# EAGLE design AS726x-Spectral_REV-D (EAGLE 6.4)
COMPANY: ADAFRUIT INDUSTRIES; DRAWN: KTOWN; REV: A
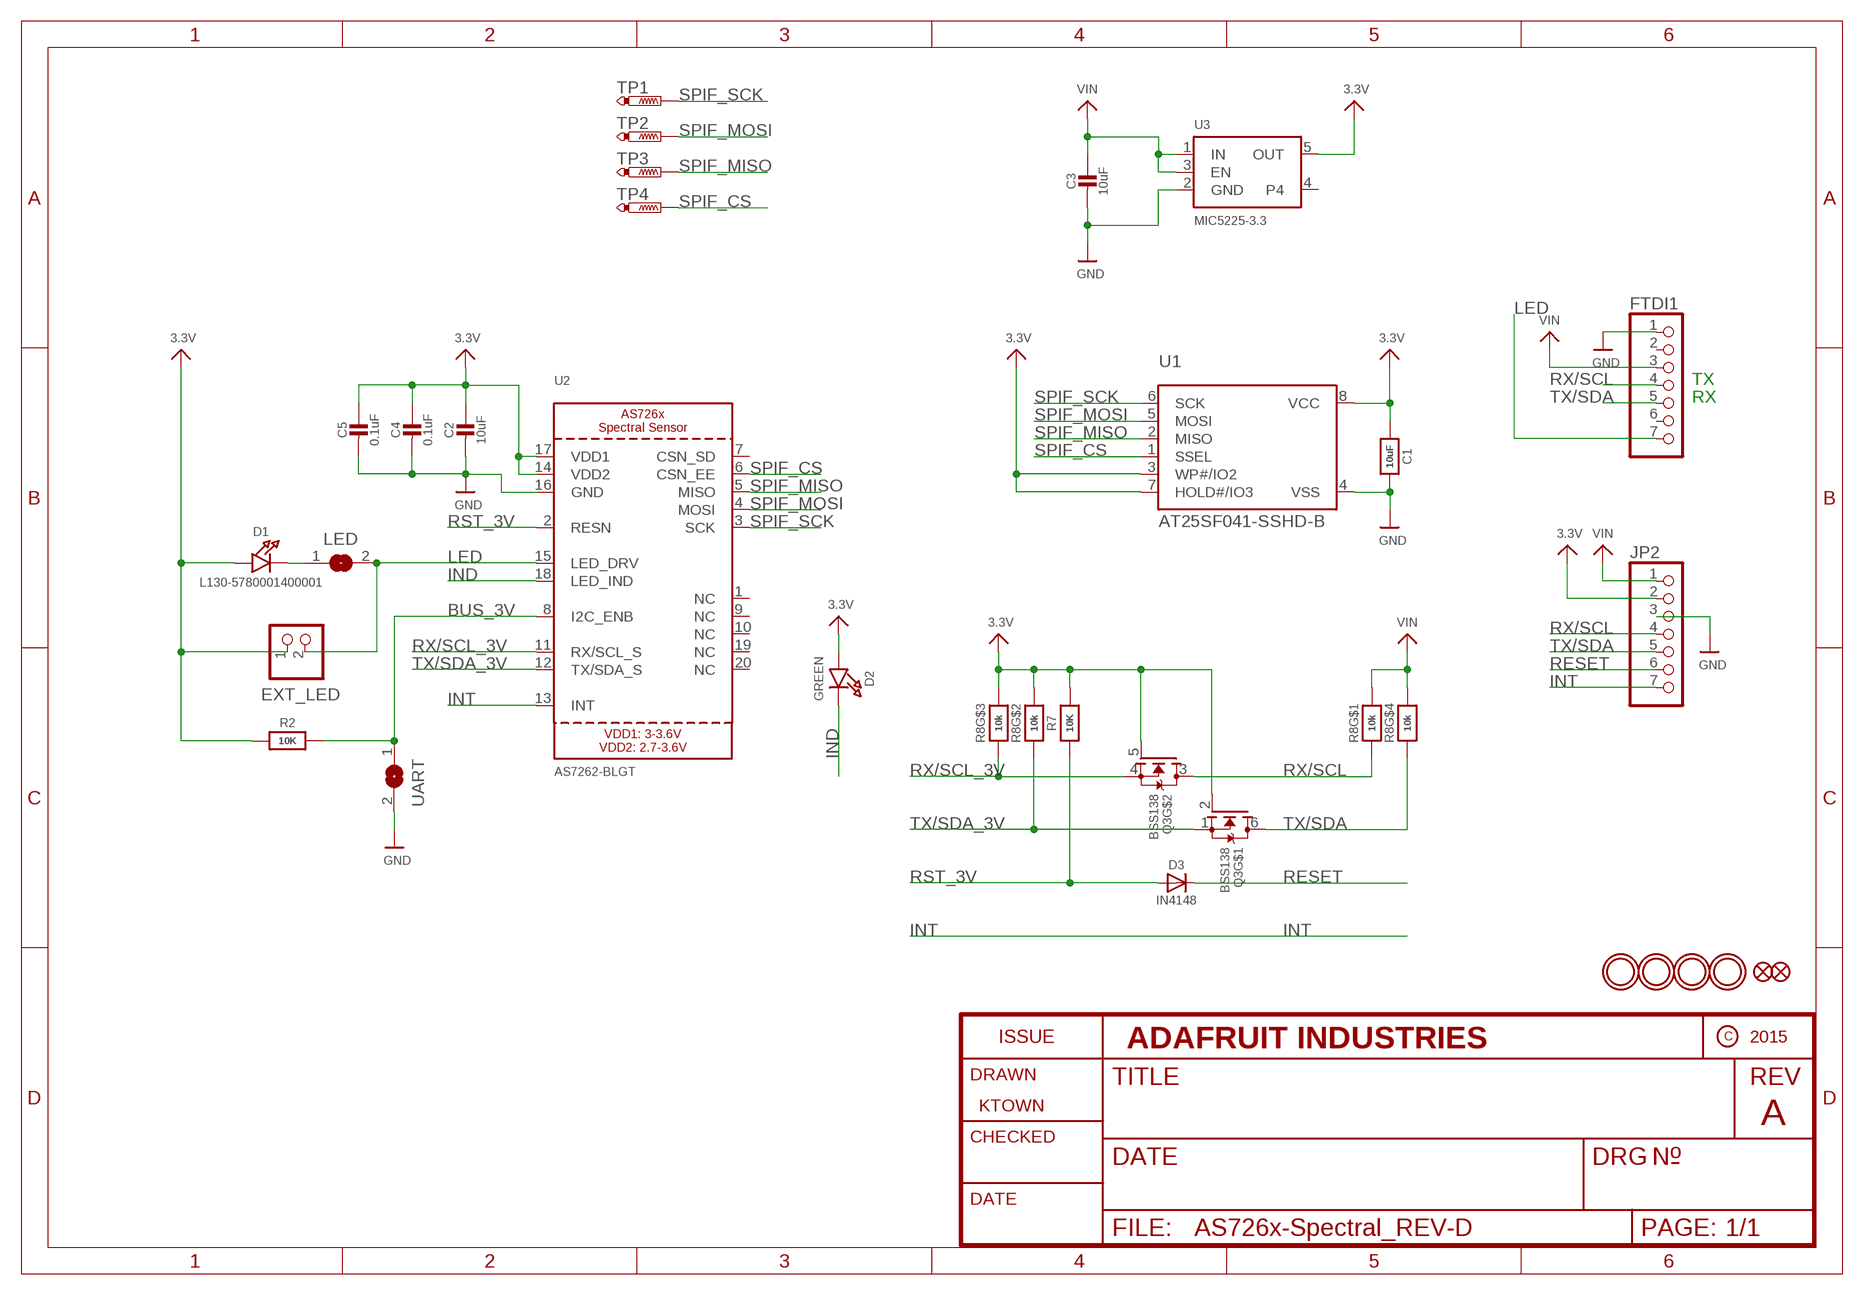
[diagram p0: schematic, sheet 1]

## Parts
C1  10uF  RESISTOR0805_NOOUTLINE  [0805-NO]
C2  10uF  CAP_CERAMIC0805-NOOUTLINE  [0805-NO]
C3  10uF  CAP_CERAMIC0805-NOOUTLINE  [0805-NO]
C4  0.1uF  CAP_CERAMIC0603_NO  [0603-NO]
C5  0.1uF  CAP_CERAMIC0603_NO  [0603-NO]
D1  L130-5780001400001  LEDEV45-21  [EVERLIGHT_45-21]
D2  GREEN  LED0805_NOOUTLINE  [CHIPLED_0805_NOOUTLINE]
D3  IN4148  DIODESOD-323  [SOD-323]
EXT_LED  HEADER-1X2ROUND  [1X02_ROUND]
FID2  FIDUCIAL_1MM  [FIDUCIAL_1MM]
FID3  FIDUCIAL_1MM  [FIDUCIAL_1MM]
FTDI1  HEADER-1X7ROUND  [1X07_ROUND]
JP2  HEADER-1X7ROUND  [1X07_ROUND]
LED  SOLDERJUMPERCLOSED  [SOLDERJUMPER_CLOSEDWIRE]
Q3  BSS138  MOSFET-N_DUAL  [SOT363]
R2  10K  RESISTOR0805_NOOUTLINE  [0805-NO]
R7  10K  RESISTOR_0603_NOOUT  [0603-NO]
R8  10k  RESISTOR_4PACK_NO  [RESPACK_4X0603_NO]
TP1  PTR1TP15R  [TP15R]
TP2  PTR1TP15R  [TP15R]
TP3  PTR1TP15R  [TP15R]
TP4  PTR1TP15R  [TP15R]
U1  AT25SF041-SSHD-B  SPIFLASH_SOIC8  [SOIC8_150MIL]
U2  AS7262-BLGT  AS726X_SPECTRAL  [AS726X_LGA20]
U3  MIC5225-3.3  VREG_SOT23-5  [SOT23-5]
U$2  MOUNTINGHOLE2.5  [MOUNTINGHOLE_2.5_PLATED]
U$3  MOUNTINGHOLE2.5  [MOUNTINGHOLE_2.5_PLATED]
U$22  MOUNTINGHOLE2.5  [MOUNTINGHOLE_2.5_PLATED]
U$23  MOUNTINGHOLE2.5  [MOUNTINGHOLE_2.5_PLATED]
UART  SOLDERJUMPER  [SOLDERJUMPER_ARROW_NOPASTE]

## Nets
3.3V: C1.1 C2.1 C4.1 C5.1 D1.A D2.A EXT_LED.1 JP2.2 Q3.2(G) Q3.5(G) R2.1 R7.2 R8.6 R8.7 U1.3(WP#/IO2) U1.7(HOLD#/IO3) U1.8(VCC) U2.14(VDD2) U2.17(VDD1) U3.5(OUT)
BUS_3V: R2.2 U2.8(I2C_ENB) UART.1
GND: C1.2 C2.2 C3.2 C4.2 C5.2 FTDI1.1 JP2.3 U1.4(VSS) U2.16(GND) U3.2(GND) UART.2
IND: D2.C U2.18(LED_IND)
INT: JP2.7 U2.13(INT)
LED: EXT_LED.2 FTDI1.7 LED.2 U2.15(LED_DRV)
N$1: D1.K(C) LED.1
RESET: D3.C JP2.6
RST_3V: D3.A R7.1 U2.2(RESN)
RX/SCL: FTDI1.4 JP2.4 Q3.3(D) R8.1
RX/SCL_3V: Q3.4(S) R8.3 U2.11(RX/SCL_S)
SPIF_CS: TP4.TP U1.1(SSEL) U2.6(CSN_EE)
SPIF_MISO: TP3.TP U1.2(MISO) U2.5(MISO)
SPIF_MOSI: TP2.TP U1.5(MOSI) U2.4(MOSI)
SPIF_SCK: TP1.TP U1.6(SCK) U2.3(SCK)
TX/SDA: FTDI1.5 JP2.5 Q3.6(D) R8.4
TX/SDA_3V: Q3.1(S) R8.2 U2.12(TX/SDA_S)
VIN: C3.1 FTDI1.3 JP2.1 R8.5 R8.8 U3.1(IN) U3.3(EN)
Unconnected: FTDI1.2 FTDI1.6 U2.1(NC) U2.7(CSN_SD) U2.9(NC) U2.10(NC) U2.19(NC) U2.20(NC) U3.4

## Notes on the sheet
- TX
- RX

## Library data of the parts
C1 R2 = microbuilder:RESISTOR: Resistors For new designs, use the packages preceded by an '_' character since they are more reliable: The following footprints should be used on most boards: _0402 - Standard footprint for regular board layouts _0603 - Standard footprint for regular board layouts _0805 - Standard footprint for regular board layouts _1206 - Standard footprint for regular board layouts For extremely tight-pitch boards where space is at a premium, the following 'micro-pitch' footprints can be used (smaller pads, no silkscreen outline, etc.): _0402MP - Micro-pitch footprint for very dense/compact boards _0603MP - Micro-pitch footprint for very dense/compact boards _0805MP - Micro-pitch footprint for very dense/compact boards _1206MP - Micro-pitch footprint for very dense/compact boards
C2-C5 = microbuilder_09_Nov_2015:CAP_CERAMIC: Ceramic Capacitors For new designs, use the packages preceded by an '_' character since they are more reliable: The following footprints should be used on most boards: _0402 - Standard footprint for regular board layouts _0603 - Standard footprint for regular board layouts _0805 - Standard footprint for regular board layouts _1206 - Standard footprint for regular board layouts For extremely tight-pitch boards where space is at a premium, the following 'micro-pitch' footprints can be used (smaller pads, no silkscreen outline, etc.): _0402MP - Micro-pitch footprint for very dense/compact boards _0603MP - Micro-pitch footprint for very dense/compact boards _0805MP - Micro-pitch footprint for very dense/compact boards _1206MP - Micro-pitch footprint for very dense/compact boards
D1 D2 = microbuilder:LED: LED 0603 - 0603 Surface Mount Package 2mA: Green LED - Low Power (3.9mcd, 2ma, 1.7Vf) - Digikey: 475-2709-2-ND Orange LED - Low Power (9.8mcd, 2ma, 1.8Vf) - Digikey: 475-1194-2-ND Red LED - Low Power (5mcd, 2ma, 1.8Vf) - Digikey: 475-1195-2-ND Yellow LED - Low Power (7mcd, 2ma, 1.8Vf) - Digikey: 475-1196-2-ND 5mA: Blue LED - Low Power (17mcd, 5ma, 2.9Vf) - Digikey: LNJ937W8CRACT-ND 0805 - 0805 Surface Mount Package 2mA: Red LED (8.8mcd, 2mA, 1.8Vf, Clear) - Low Power [Digikey: 475-2510-1-ND] Green LED (5mcd, 2mA, 1.8Vf, Clear) - Low Power [Digikey: 475-2730-1-ND] Yellow LED (11.3mcd, 2mA, 1.8Vf, Clear) - Low Power [Digikey: 475-2555-1-ND] 20mA: Red LED (104mcd, 20mA, Diffused) - LS R976 [Digikey: 475-1278-6-ND] Red LED (12mcd, 20mA, 2.0Vf, Clear) - APT2012EC [Digikey: 754-1128-1-ND] Green LED (15mcd, 20mA, 2.2Vf, Clear) - APT2012GC [Digikey: 754-1131-1-ND] Orange LED (160mcd, 20mA, 2.1Vf, Clear) - APT2012SECK [Digikey: 754-1130-1-ND] 1206 - 1206 Surface Mount Package Green LED (26mcd, 20mA, Diffused) - LG N971 [Digikey: 475-1407-6-ND] Red LED (15mcd, 20mA, Diffused) - LH N974 [Digikey: 475-1416-6-ND] Cree - Cree High-Power Surface Mount LEDs XPEBWT-L1-0000-00D50 - White 111lm 350mA 2.9Vf 6200K 110° XTEAWT-00-0000-00000LEE3 - White 114lm 350mA 2.85Vf 5000K 115° Everlight - Everlight 45-21 Series Surface Mount LEDs 45-21/QK2C-B2832AC2CB2/2T - Warm White 2000mcd 20mA 3.25Vf 3050K 120° 45-21/LK2C-B38452C4CB2/2T - Nuetral White 2000mcd 20mA 3.25Vf 4150K 120° 45-21/LK2C-B50634C6CB2/2T - Cold White 2200mcd 20mA 3.25Vf 5650K 120° PLCC2 Reverse Mount LS T77K-J1L2-1-0-2-R18-Z - Red 11.25mcd 2mA 1.8Vf 630nm 120° LO T77K-L1M2-24-Z - Orange 19.6mcd 2mA 1.8Vf 606nm 120° LY T77K-K2M1-26-Z - Yellow 15.7mcd 2mA 1.8Vf 587nm 120°
D3 = microbuilder:DIODE: Diode SMA Model Volts Amps Type Vf Ir Digikey # Notes SSA34-E3 40V 3A Schottky 480mV @ 3A 200uA @ 40V SSA34-E3/61TGITR-ND CDBA120-G 20V 1A Schottky 500mV @ 1A 500uA @ 20V 641-1014-6-ND REEL MBRA210 10V 2A Schottky 350mV @ 2A 700uA @ 10V MBRA210LT3 SOD-123 Model Volts Amps Type Vf Ir Order # Notes BAT54T1G 30V 200mA Schottky 800mV @ 200mA 2uA @ 25V BAT54T1GOSTR-ND B0530W 30V 500mA Schottky 430mV @ 500mA 130uA @ 30V B0530W-FDICT-ND REEL MBR120 20V 1A Schottky 340mV @ 1A MBR120VLSFT1GOSCT-ND SOD-323 Model Volts Amps Type Vf Ir Order # Notes PMEG2005EJ 20V 500mA Schottky 355mV @ 500mA 568-4110-1-ND ZLLS410 10V 570mA Schottky 380mV @ 570mA ZLLS410CT-ND 1N4148WS 75V 150mA Silicon/Simple 1V 1N4148WSFSCT-ND REEL SOD-523 Model Volts Amps Type Vf Ir Order # Notes BAT54XV2 30V 200mA Schottky 0.8V @ 100mA BAT54XV2CT-ND TB751S 30V 30mA Schottky RB751S-40TE61CT-ND SOT23-R/W (R = Solder Paste/Reflow Ovens, W = Hand-Soldering) Model Volts Amps Type Vf Ir Order # Notes BAT54FILM 40V 300mA Schottky 497-7162-1-ND POWERDI-5 Model Volts Amps Type Vf Ir Order # Notes PDS560 60V 5A Schottky 670mV @ 5A 150uA @ 60V PDS560DICT-ND
EXT_LED = microbuilder:HEADER-1X2: PIN HEADER
FID2 FID3 = microbuilder:FIDUCIAL: Fiducial Alignment Points Various fiducial points for machine vision alignment.; BOM: EXCLUDE
FTDI1 JP2 = microbuilder:HEADER-1X7: PIN HEADER
LED = microbuilder:SOLDERJUMPER: SMD Solder JUMPER Solder the two pads together to create a connection, or remove the solder to break it. REFLOW - Use this footprint for solder paste and reflow ovens. WAVE - Use this footprint for hand-soldering (larger pads). CLOSED - Has a trace between the two pads to ensure it is closed by default. The trace needs to be cut to disable the jumper, and can be closed again by creating a solder bridge between the two pads.
Q3 = microbuilder:MOSFET-N_DUAL: Dual N-Channel MOSFET SOT363 (2.0x1.25mm) 2N7002PS - 60V, 320mA [Digikey: 568-5984-1-ND]
R7 = microbuilder_09_Nov_2015:RESISTOR: Resistors For new designs, use the packages preceded by an '_' character since they are more reliable: The following footprints should be used on most boards: _0402 - Standard footprint for regular board layouts _0603 - Standard footprint for regular board layouts _0805 - Standard footprint for regular board layouts _1206 - Standard footprint for regular board layouts For extremely tight-pitch boards where space is at a premium, the following 'micro-pitch' footprints can be used (smaller pads, no silkscreen outline, etc.): _0402MP - Micro-pitch footprint for very dense/compact boards _0603MP - Micro-pitch footprint for very dense/compact boards _0805MP - Micro-pitch footprint for very dense/compact boards _1206MP - Micro-pitch footprint for very dense/compact boards
R8 = microbuilder:RESISTOR_4PACK: Resistor Packs (4 resistors) 4 x 0603 10K 1/16W - Digikey: YC164J-10KCT-ND
TP1-TP4 = testpad:PTR1: TEST PIN
U1 = microbuilder_09_Nov_2015:SPIFLASH_SOIC8: SOIC8 SPI Flash Be careful with the size since SOIC8 flash comes in several 'widths' SOIC8 150 mil M25P16 - 16Mbit (2Mbit x 8) Serial Flash (75MHz SPI Bus), Supply: 2.7-3.6V Digikey: SOIC8 - M25P16-VMN6P-ND SOIC8 208 mil W25Q16BVSSIG - 16Mbit (2Mbit x 8) Serial Flash (104MHz SPI Bus), Supply: 2.7-3.6V Digikey: SOIC8 - W25Q16BVSSIG-ND
U2 = microbuilder:AS726X_SPECTRAL: AS726x Spectral Sensor
U3 = microbuilder:VREG_SOT23-5: SOT23-5 Fixed Voltage Regulators Part Current Out V Out V In V Dropout θJA (°C/W) TJ (°C) Digikey Part No. ADP121 150mA 3.3V 3.4-5.5V 0.09V @ 150mA -- -- ADP121-AUJZ33R7CT-ND ADP121 150mA 3.0V 3.1-5.5V 0.09V @ 150mA -- -- ADP121-AUJZ30R7CT-ND ADP122 300mA 3.3V 3.4-5.5V 0.085V @ 300mA -- -- ADP122AUJZ-3.3-R7CT-ND ADP1712 300mA 3.3V 3.5-5.5V 0.17V @ 300mA -- -- ADP1712AUJZ-3.3-R7TR-ND AP7311 (Low Cost) 150mA 3.3V 3.5-6V 0.15V @ 150mA -- -- AP7311-33WG-7DICT-ND LD39015M18R 150mA 1.8V 1.9V-5.5V 0.08V @ 100mA -- -- 497-6977-1-ND LP2985A-33DBVR 150mA 3.3V 3.3-16V 0.28V @ 150mA 206 150 296-18479-1-ND MCP1824T-3302E/OT 300mA 3.3V 3.5V-6V 0.2V @ 300mA -- -- MCP1824T-3302E/OTCT-ND MIC5205-2.5YM5 TR 150mA 2.5V 2.7-16V 0.165V @ 150mA -- -- 576-1257-2-ND MIC5205-3.0YM5 TR 150mA 3.0V 3.2V-16V 0.165V @ 150mA -- -- 576-1258-2-ND MIC5205-3.3YM5 TR 150mA 3.3V 3.5V-16V 0.165V @ 150mA -- -- 576-1259-2-ND TPS780330220 150mA 3.3V+2.2V 3.6-5.5V 250mV Max -- -- 296-23332-1-ND TDA3663/N1,135 100mA 3.3V 3.5-45V 0.18V @ 50mA -- -- 568-5343-1-ND Max operating temp can be calculated using θJA, TJ (max junction temperature), and power in watts. Set the "Maximum Ambient Temperature" until it reaches TJ ("Max Junction Temperature"), which is the absolute limit for safe use of the regulator: Heat Sink Temperature Calculator <http://www.daycounter.com/Calculators/Heat-Sink-Temperature-Calculator.phtml> For example, With 12V source into a 3.3V LP2985 and a 30mA load, we are dissipating (12V-3.3V) * 0.03A = 0.261W. With a θJA of 206 °C/W, a TJ of 150°C, and 261mW we can safely use the chip without a heat sink up to 75°C (=147.1°C Junction Temperature).
U$2 U$3 U$22 U$23 = microbuilder:MOUNTINGHOLE: Mounting Hole For #2 screws (0.086"/2.18mm width, 0.094"/2.4mm hole) use 2.5mm; BOM: EXCLUDE
UART = microbuilder:SOLDERJUMPER: SMD Solder JUMPER Solder the two pads together to create a connection, or remove the solder to break it. REFLOW - Use this footprint for solder paste and reflow ovens. WAVE - Use this footprint for hand-soldering (larger pads). CLOSED - Has a trace between the two pads to ensure it is closed by default. The trace needs to be cut to disable the jumper, and can be closed again by creating a solder bridge between the two pads.; BOM: EXCLUDE

## Board
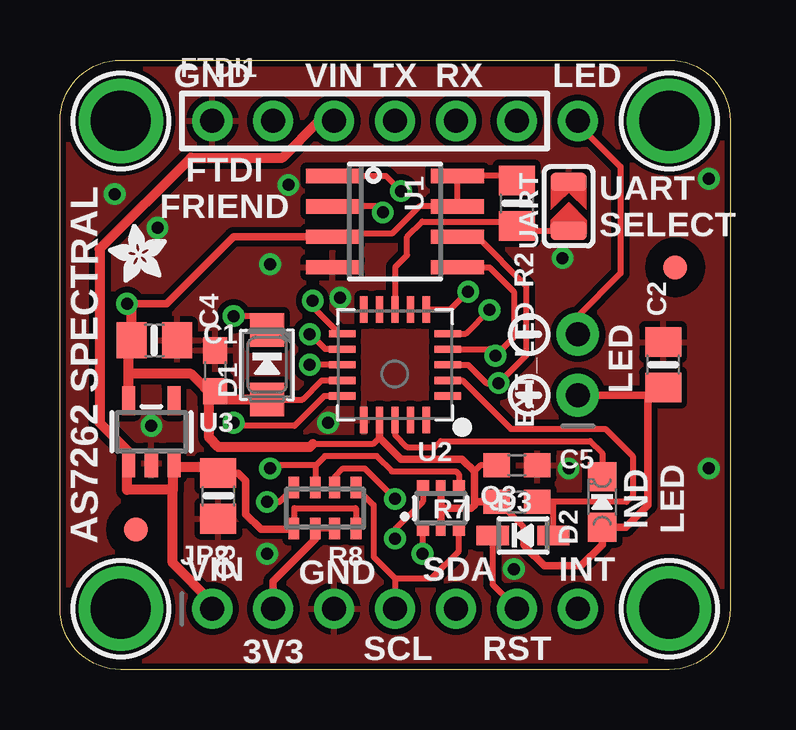
[diagram p1: board, top side]
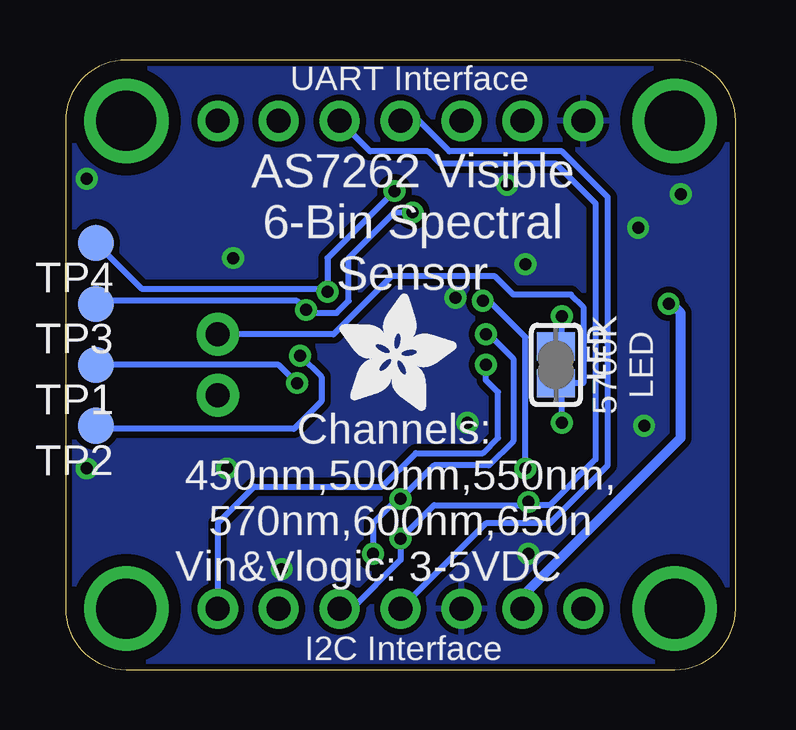
[diagram p2: board, bottom side, seen from below]

Size 27.94 x 25.4 mm. Coordinates in mm from the lower left corner, seen from the top.
Outline: 2.54,25.4 25.4,25.4 arc-90 27.94,22.86 27.94,2.54 arc-90 25.4,0 2.54,0 arc-90 0,2.54 0,22.86 arc-90 2.54,25.4
Copper layers (1*16): Top 0.035mm / dielectric 1.5mm / Bottom 0.035mm
Design rules "adafruit *": minimum track width 8mil, minimum drill 15.5mil, track to track 8mil, track to pad 8mil, pad to pad 8mil, via to via 8mil, smd to smd 8mil, copper to edge 10mil, drill to drill 8mil, minimum pad ring 10mil, minimum via ring 8mil, stop-mask expansion 2mil, vias tented up to drill 20mil, thermal gap 10mil

### Footprints (pad centres in the part's own frame; a part is rotated, then mirrored left to right if it is on the bottom)
0805-NO = smd 1.24 x 1.5: 1 -0.95,0; 2 0.95,0
0603-NO = smd 1.1 x 1: 1 -0.85,0; 2 0.85,0
EVERLIGHT_45-21 = smd 1.4 x 1.4: A -1.45,0; K 1.45,0
CHIPLED_0805_NOOUTLINE = smd 1.2 x 1.2: A 0,-1.05; C 0,1.05
SOD-323 = smd 1.35 x 0.8: A 1.27,0; C -1.27,0
1X02_ROUND = drill 1 pad 1.778: 1 -1.27,0; 2 1.27,0
FIDUCIAL_1MM = smd 1 x 1: 1 0,0
1X07_ROUND = drill 1 pad 1.676: 1 -7.62,0; 2 -5.08,0; 3 -2.54,0; 4 0,0; 5 2.54,0; 6 5.08,0; 7 7.62,0
SOLDERJUMPER_CLOSEDWIRE = smd 1.168 x 1.6: 1 -0.762,0; 2 0.762,0 | smd 0.635 x 0.203: WIRE 0,0
SOT363 = smd 0.5 x 0.5: 1 -0.75,-0.9; 3 0.75,-0.9; 4 0.75,0.9; 6 -0.75,0.9 | smd 0.4 x 0.5: 2 0,-0.9; 5 0,0.9
RESPACK_4X0603_NO = smd 0.45 x 0.9: 1 -1.3,-0.85; 2 -0.4,-0.85; 3 0.4,-0.85; 4 1.3,-0.85; 5 1.3,0.85; 6 0.4,0.85; 7 -0.4,0.85; 8 -1.3,0.85
TP15R = smd 1.5 x 1.5: TP 0,0
SOIC8_150MIL = smd 0.6 x 2.2: 1 -1.905,-2.6; 2 -0.635,-2.6; 3 0.635,-2.6; 4 1.905,-2.6; 5 1.905,2.6; 6 0.635,2.6; 7 -0.635,2.6; 8 -1.905,2.6
AS726X_LGA20 = smd 1.1 x 0.3: 1 -2.2,1.3; 2 -2.2,0.65; 3 -2.2,0; 4 -2.2,-0.65; 5 -2.2,-1.3; 11 2.2,-1.3; 12 2.2,-0.65; 13 2.2,0; 14 2.2,0.65; 15 2.2,1.3 | smd 0.3 x 1.1: 6 -1.3,-2.3; 7 -0.65,-2.3; 8 0,-2.3; 9 0.65,-2.3; 10 1.3,-2.3; 16 1.3,2.3; 17 0.65,2.3; 18 0,2.3; 19 -0.65,2.3; 20 -1.3,2.3
SOT23-5 = smd 0.55 x 1.2: 1 -0.95,-1.3; 2 0,-1.3; 3 0.95,-1.3; 4 0.95,1.3; 5 -0.95,1.3
MOUNTINGHOLE_2.5_PLATED = drill 2.5 pad 3.2: P$1 0,0
SOLDERJUMPER_ARROW_NOPASTE = smd 0.762 x 1.524: 1 -1.016,0; 2 1.016,0

### Placement (x,y rotation side)
C1  3.94,13.72 0 top
C2  25.15,12.7 90 top
C3  6.6,7.24 270 top
C4  6.48,12.45 90 top
C5  19.05,8.51 0 top
D1  8.64,12.7 90 top
D2  22.61,6.99 0 top
D3  19.3,5.59 0 top
EXT_LED  21.59,12.7 90 top
FID2  3.17,5.84 180 top
FID3  25.65,16.76 180 top
FTDI1  13.97,22.86 0 top
JP2  13.97,2.54 0 top
LED  7.49,12.7 270 bottom
Q3  15.88,6.73 0 top
R2  19.05,19.43 270 top
R7  19.05,6.99 180 top
R8  11.05,6.73 180 top
TP1  26.67,12.7 180 bottom
TP2  26.67,10.16 180 bottom
TP3  26.67,15.24 180 bottom
TP4  26.67,17.78 180 bottom
U1  13.97,18.67 270 top
U2  13.97,12.7 180 top
U3  3.81,9.91 0 top
U$2  25.4,2.54 180 top
U$3  2.54,2.54 180 top
U$9  [ADAFRUIT_5MM]  16.51,10.79 0 bottom
U$21  [ADAFRUIT_2.5MM]  4.45,16.13 90 top
U$22  25.4,22.86 180 top
U$23  2.54,22.86 180 top
U$25  [SYMBOL_PLUS]  19.56,11.43 0 top
U$26  [SYMBOL_MINUS]  19.56,13.97 0 top
UART  21.21,19.3 90 top

### Tracks (layer width: path | path; a pad name or v marks a point on that pad's centre or on a via)
3.3V  (via drill 0.5)
  Top 0.254: U1.3 11.5,18.16 13.84,18.16 14.99,19.3 U1.7 U1.8 18.86,20.57 R2.1 | C2.1 24.83,11.43 | R8.6 R8.7 | 24.51,11.3 24.64,11.43 | D1.A 10.11,11.25 10.91,12.05 U2.14 | 13.32,9.67 13.05,9.4 10.54,9.4 | C5.1 17.53,8.51 17.27,8.26 | R7.2 18.29,6.99 19.3,5.97 19.3,5.21 19.43,5.08
  Top 0.305: R8.6 10.65,5.44 8.89,3.68 JP2.2 | U1.3 7.24,18.03 4.45,15.24 v2.79,15.24 | 24.83,11.43 24.64,11.43 EXT_LED.1 | Q3.5 15.88,6.73 | 15.88,6.73 Q3.2 | 15.88,6.73 17.14,6.73 17.27,6.86 17.27,6.99 | U2.17 13.32,9.67 14.22,8.76 16.76,8.76 17.27,8.26 17.27,6.99 | R7.2 17.27,6.99 | 24.51,11.3 24.51,6.86 23.59,5.93 D2.A 22.61,5.21 21.72,4.32 20.19,4.32 19.43,5.08
  Top 0.406: U3.5 2.86,12.32 | D1.A 6.53,11.25 | 6.53,11.25 5.46,12.32 2.86,12.32 | 10.54,9.4 10.41,9.27 6.6,9.27 6.22,9.65 6.22,11.6 C4.1 6.53,11.6 6.53,11.25 | 2.86,12.32 2.86,13.72 C1.1 2.99,15.24 v2.79,15.24
  Bottom 0.406: JP2.2 8.89,3.05 2.29,9.65 2.29,14.86 2.79,15.37 v2.79,15.24
BUS_3V
  Top 0.254: U2.8 13.97,16.76 14.48,17.27 14.48,18.03 15.11,18.67 19.05,18.67 R2.2 19.24,18.29 UART.1
GND  (via drill 0.5)
  other vias: 8.64,4.83 3.81,10.16 8.76,16.89 9.53,20.19 27.05,20.45 18.92,4.19 11.18,10.29 11.68,15.49 4.06,18.41 2.29,19.81 20.95,17.14 27.05,8.38 21.21,8.38
  pour Bottom (isolate 0.254): 27.94,25.4 27.94,0 0,0 0,25.4
  pour Top (isolate 0.254): 0,0 0,25.4 27.94,25.4 27.94,0
IND
  Top 0.254: U2.18 13.97,9.78 14.48,9.27 15.62,9.27 15.88,9.53 22.1,9.53 22.61,9.02 D2.C
INT  (via drill 0.5)
  Top 0.254: U2.13 v10.41,12.7
  Bottom 0.254: JP2.7 21.59,6.1 20.07,7.62 14.73,7.62 13.34,9.02 10.54,9.02 9.91,9.65 9.91,11.56 10.41,12.06 v10.41,12.7
LED  (via drill 0.5)
  Top 0.254: U2.15 11.02,11.4 9.78,10.16 7.37,10.16 v7.24,10.29 | FTDI1.7 21.59,22.73 23.37,20.95 23.37,16.51 21.59,14.73 EXT_LED.2
  Bottom 0.254: v7.24,10.29 7.24,11.43 7.49,11.68 LED.2 6.35,11.94 6.35,15.11 6.86,15.62 9.27,15.62 10.03,16.38 14.35,16.38 16.76,13.97 EXT_LED.2
N$1  (via drill 0.5)
  Top 0.254: D1.K 8.05,14.73 v7.24,14.73
  Bottom 0.254: LED.1 7.24,13.72 v7.24,14.73
RESET
  Top 0.254: D3.C 18.03,3.56 JP2.6
RST_3V
  Top 0.254: U2.2 16.78,12.05 18.8,10.03 22.73,10.03 23.88,8.89 23.88,7.24 23.62,6.99 R7.1 20.64,6.99 20.57,6.92 D3.A
RX/SCL
  Top 0.254: R8.1 13.08,6.85 13.08,4.7 13.97,3.81 | 13.97,3.81 JP2.4 | 13.97,3.81 15.49,3.81 16.62,4.94 Q3.3
  Bottom 0.254: JP2.4 10.41,6.1 7.75,6.1 5.33,8.51 5.33,19.68 7.24,21.59 11.94,21.59 13.21,22.86 FTDI1.4
RX/SCL_3V  (via drill 0.5)
  Top 0.254: Q3.4 16.62,8.14 16.51,8.26 13.84,8.26 13.21,8.89 11.05,8.89 10.67,8.51 | 10.67,8.51 8.89,8.51 v8.76,8.38 | R8.3 10.67,7.58 10.67,8.51 | U2.11 11.65,14 10.54,15.11 v10.54,15.37
  Bottom 0.254: 10.41,15.37 v10.54,15.37 10.29,15.37 8.76,13.84 v8.76,8.38
SPIF_CS  (via drill 0.5)
  Top 0.254: v17.02,15.75 16.27,15 U2.6 | U1.1 13.59,20.57 v14.22,19.94
  Bottom 0.254: TP4.TP 24.77,15.88 17.02,15.88 v17.02,15.75 17.02,17.14 v14.22,19.94
SPIF_MISO  (via drill 0.5)
  Top 0.254: U2.5 16.92,14 v17.91,14.99 | v13.46,19.05 13.21,19.3 U1.2
  Bottom 0.254: v13.46,19.05 14.22,19.05 16.13,17.14 16.13,15.37 16.64,14.86 17.78,14.86 v17.91,14.99 18.29,15.37 26.16,15.37 26.29,15.24 TP3.TP
SPIF_MOSI  (via drill 0.5)
  Top 0.254: U1.5 17.91,16.76 18.92,15.75 18.92,13.84 v18.16,13.08 17.89,13.35 U2.4
  Bottom 0.254: v18.16,13.08 17.27,12.19 17.27,11.18 18.41,10.03 26.54,10.03 TP2.TP
SPIF_SCK  (via drill 0.5)
  Top 0.254: U2.3 17.02,12.7 17.78,11.94 v18.29,11.94 19.43,13.08 19.43,16 17.4,18.03 U1.6
  Bottom 0.254: v18.29,11.94 19.05,12.7 TP1.TP
TX/SDA  (via drill 0.5)
  Top 0.254: Q3.6 15.12,7 13.97,5.84 v13.97,5.46 | R8.4 9.15,6.99 v8.64,6.99
  Bottom 0.254: 8.64,6.86 12.57,6.86 v13.97,5.46 13.97,4.57 16,2.54 JP2.5 | 8.64,6.86 7.75,6.86 5.84,8.76 5.84,19.43 7.49,21.08 12.32,21.08 12.83,21.59 15.24,21.59 FTDI1.5 | 8.64,6.86 v8.64,6.99
TX/SDA_3V  (via drill 0.5)
  Top 0.254: v13.97,7.11 12.7,8.38 11.81,8.38 11.45,8.02 R8.2 | U2.12 11.06,13.35 10.44,13.97 v10.41,13.97 | Q3.1 v15.11,4.83
  Bottom 0.254: v15.11,4.83 15.11,6.1 13.97,7.24 v13.97,7.11 12.57,8.51 10.29,8.51 9.27,9.53 9.27,12.95 10.29,13.97 v10.41,13.97
VIN
  Top 0.254: R8.5 9.78,5.91 9.78,6.73 12.32,6.73 12.35,6.7 R8.8
  Top 0.305: R8.5 9.71,5.84 8.38,5.84 7.75,6.48 7.75,7.87 7.43,8.19 C3.1
  Top 0.406: C3.1 6.35,8.44 4.92,8.44 U3.3 4.7,8.67 4.7,7.49 | 4.7,7.49 2.79,7.49 2.79,8.61 U3.1 2.86,9.08 1.65,10.29 1.65,17.53 5.46,21.34 9.27,21.34 10.79,22.86 FTDI1.3 | JP2.1 6.35,2.79 4.7,4.45 4.7,7.49

### Text on the board
tPlace: GND | VIN | TX | RX | LED | FTDI / FRIEND | UART / SELECT | AS7262 SPECTRAL | LED | IND / LED | VIN | GND | SDA | INT | 3V3 | SCL | RST
bPlace: UART Interface | AS7262 Visible / 6-Bin Spectral / Sensor | 5700K / LED | Channels: / 450nm,500nm,550nm, / 570nm,600nm,650n | Vin&Vlogic: 3-5VDC | I2C Interface